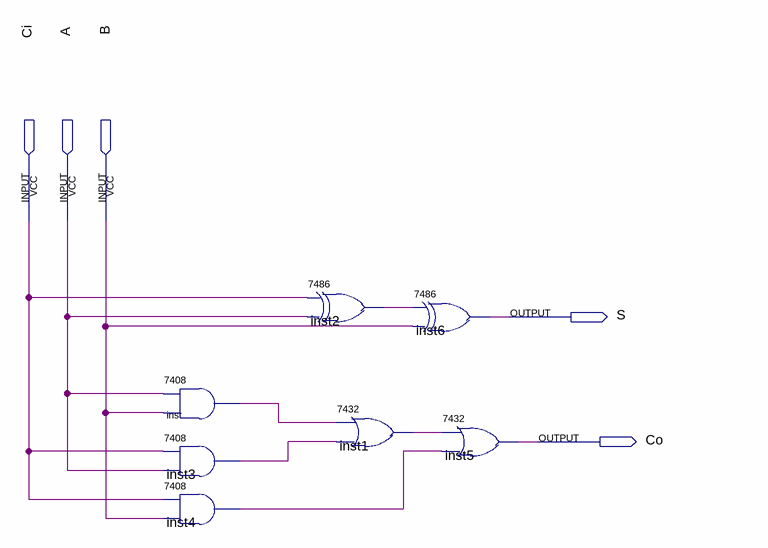
[diagram p0: schematic sheet]
// Quartus schematic 1fa.bdf as structural Verilog: 7 symbols, 5 pins
module \1fa  (
  input  Ci,
  input  A,
  input  B,
  output S,
  output Co
);

  wire inst1_1, inst2_1, inst3_1, inst4_1, inst_1;

  \7408  inst (.\3 (B), .\2 (A), .\1 (inst_1));
  \7408  inst3 (.\3 (A), .\2 (Ci), .\1 (inst3_1));
  \7408  inst4 (.\3 (B), .\2 (Ci), .\1 (inst4_1));
  \7486  inst2 (.\2 (Ci), .\3 (A), .\1 (inst2_1));
  \7432  inst1 (.\2 (inst_1), .\3 (inst3_1), .\1 (inst1_1));
  \7486  inst6 (.\2 (inst2_1), .\3 (B), .\1 (S));
  \7432  inst5 (.\2 (inst1_1), .\3 (inst4_1), .\1 (Co));
endmodule
